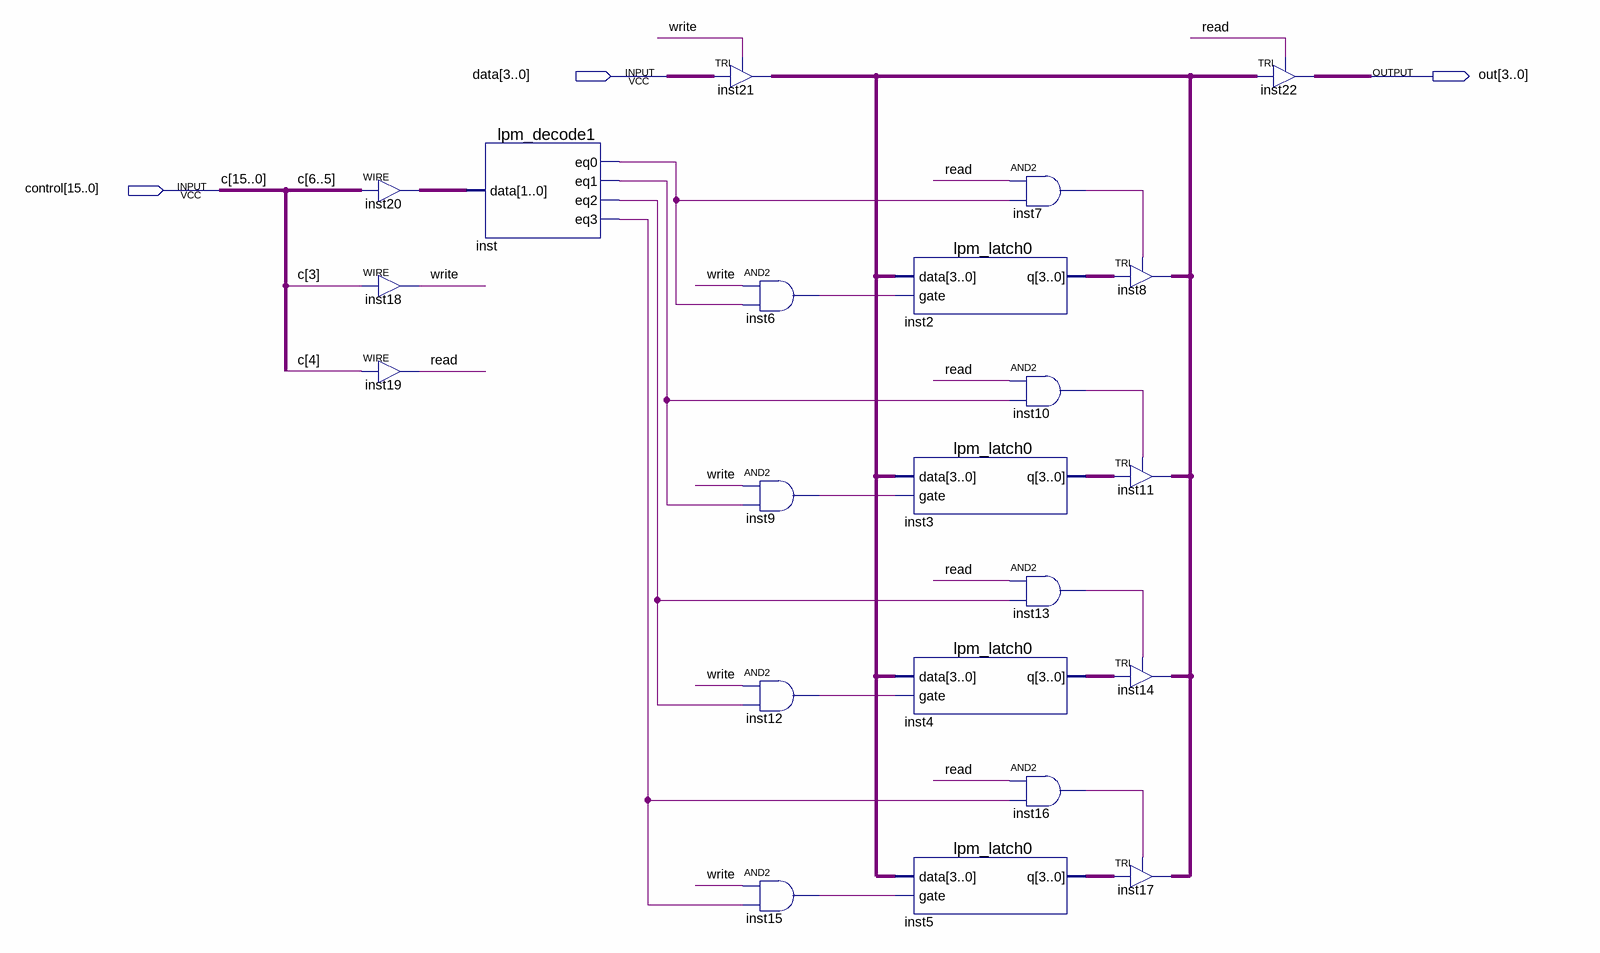
[diagram p0: schematic sheet]
// Quartus schematic registers.bdf as structural Verilog: 22 symbols, 3 pins
module registers (
  input  [3:0] data,
  input  [15:0] control,
  output [3:0] out
);

  wire inst6_out, inst7_out, inst9_out, inst10_out, inst12_out, inst13_out, inst15_out, inst16_out, inst_eq0,
       inst_eq1, inst_eq2, inst_eq3, read, write;
  wire [1:0] inst20_out;
  wire [3:0] inst2_q, inst3_q, inst4_q, inst5_q, inst21_out;

  assign inst20_out = control[6:5];  // WIRE inst20
  assign write = control[3];  // WIRE inst18
  assign read = control[4];  // WIRE inst19
  lpm_decode1 inst (.data(inst20_out), .eq0(inst_eq0), .eq1(inst_eq1), .eq2(inst_eq2), .eq3(inst_eq3));
  TRI inst21[3:0] (.IN(data), .OE(write), .OUT(inst21_out));
  and inst6 (inst6_out, write, inst_eq0);
  and inst9 (inst9_out, write, inst_eq1);
  and inst12 (inst12_out, write, inst_eq2);
  and inst15 (inst15_out, write, inst_eq3);
  lpm_latch0 inst2 (.data(inst21_out), .gate(inst6_out), .q(inst2_q));
  lpm_latch0 inst3 (.data(inst21_out), .gate(inst9_out), .q(inst3_q));
  lpm_latch0 inst4 (.data(inst21_out), .gate(inst12_out), .q(inst4_q));
  lpm_latch0 inst5 (.data(inst21_out), .gate(inst15_out), .q(inst5_q));
  and inst7 (inst7_out, read, inst_eq0);
  and inst10 (inst10_out, read, inst_eq1);
  and inst13 (inst13_out, read, inst_eq2);
  and inst16 (inst16_out, read, inst_eq3);
  TRI inst8[3:0] (.IN(inst2_q), .OE(inst7_out), .OUT(inst21_out));
  TRI inst11[3:0] (.IN(inst3_q), .OE(inst10_out), .OUT(inst21_out));
  TRI inst14[3:0] (.IN(inst4_q), .OE(inst13_out), .OUT(inst21_out));
  TRI inst17[3:0] (.IN(inst5_q), .OE(inst16_out), .OUT(inst21_out));
  TRI inst22[3:0] (.IN(inst21_out), .OE(read), .OUT(out));

  // Other names for the same wires on the sheet: c[15:0] = control
endmodule
